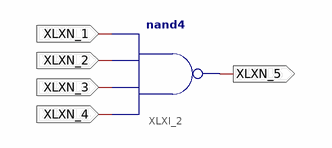
[diagram p0: schematic sheet 1]
// Xilinx ISE schematic schem.sch (aspartan3) as structural Verilog: 1 symbols, 5 ports
module schem (
  input  XLXN_1,
  input  XLXN_2,
  input  XLXN_3,
  input  XLXN_4,
  output XLXN_5
);

  nand XLXI_2 (XLXN_5, XLXN_4, XLXN_3, XLXN_2, XLXN_1);
endmodule
